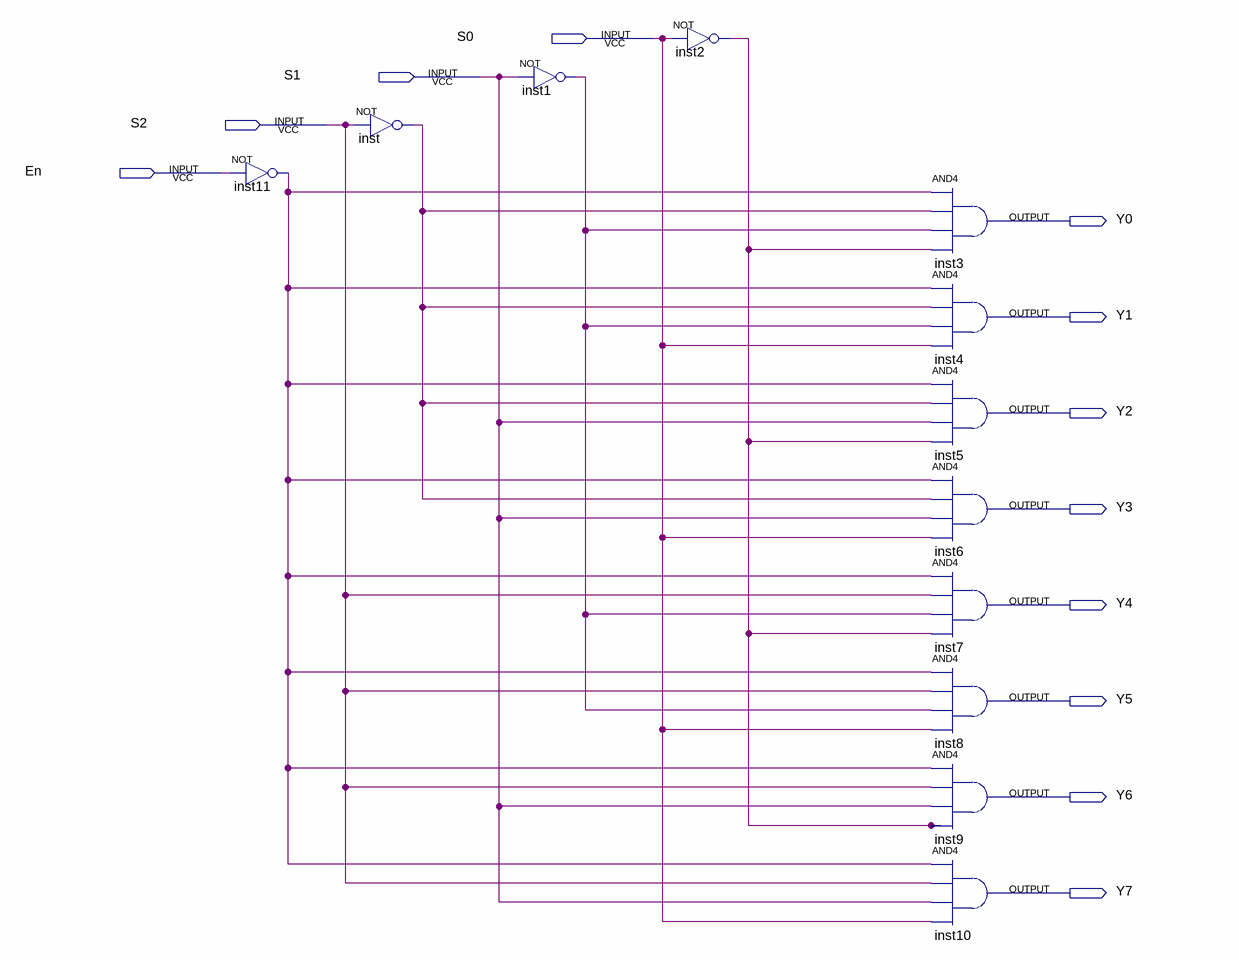
[diagram p0: schematic sheet]
// Quartus schematic decoder.bdf as structural Verilog: 12 symbols, 12 pins
module decoder (
  input  S0,
  input  S1,
  input  S2,
  input  En,
  output Y0,
  output Y1,
  output Y2,
  output Y3,
  output Y4,
  output Y5,
  output Y6,
  output Y7
);

  wire inst1_out, inst2_out, inst11_out, inst_out;

  not inst11 (inst11_out, En);
  not inst (inst_out, S2);
  not inst1 (inst1_out, S1);
  not inst2 (inst2_out, S0);
  and inst3 (Y0, inst11_out, inst_out, inst1_out, inst2_out);
  and inst4 (Y1, inst11_out, inst_out, inst1_out, S0);
  and inst5 (Y2, inst11_out, inst_out, S1, inst2_out);
  and inst6 (Y3, inst11_out, inst_out, S1, S0);
  and inst7 (Y4, inst11_out, S2, inst1_out, inst2_out);
  and inst8 (Y5, inst11_out, S2, inst1_out, S0);
  and inst9 (Y6, inst11_out, S2, S1, inst2_out);
  and inst10 (Y7, inst11_out, S2, S1, S0);
endmodule
